# EAGLE schematic pcb (EAGLE 9.5.2)
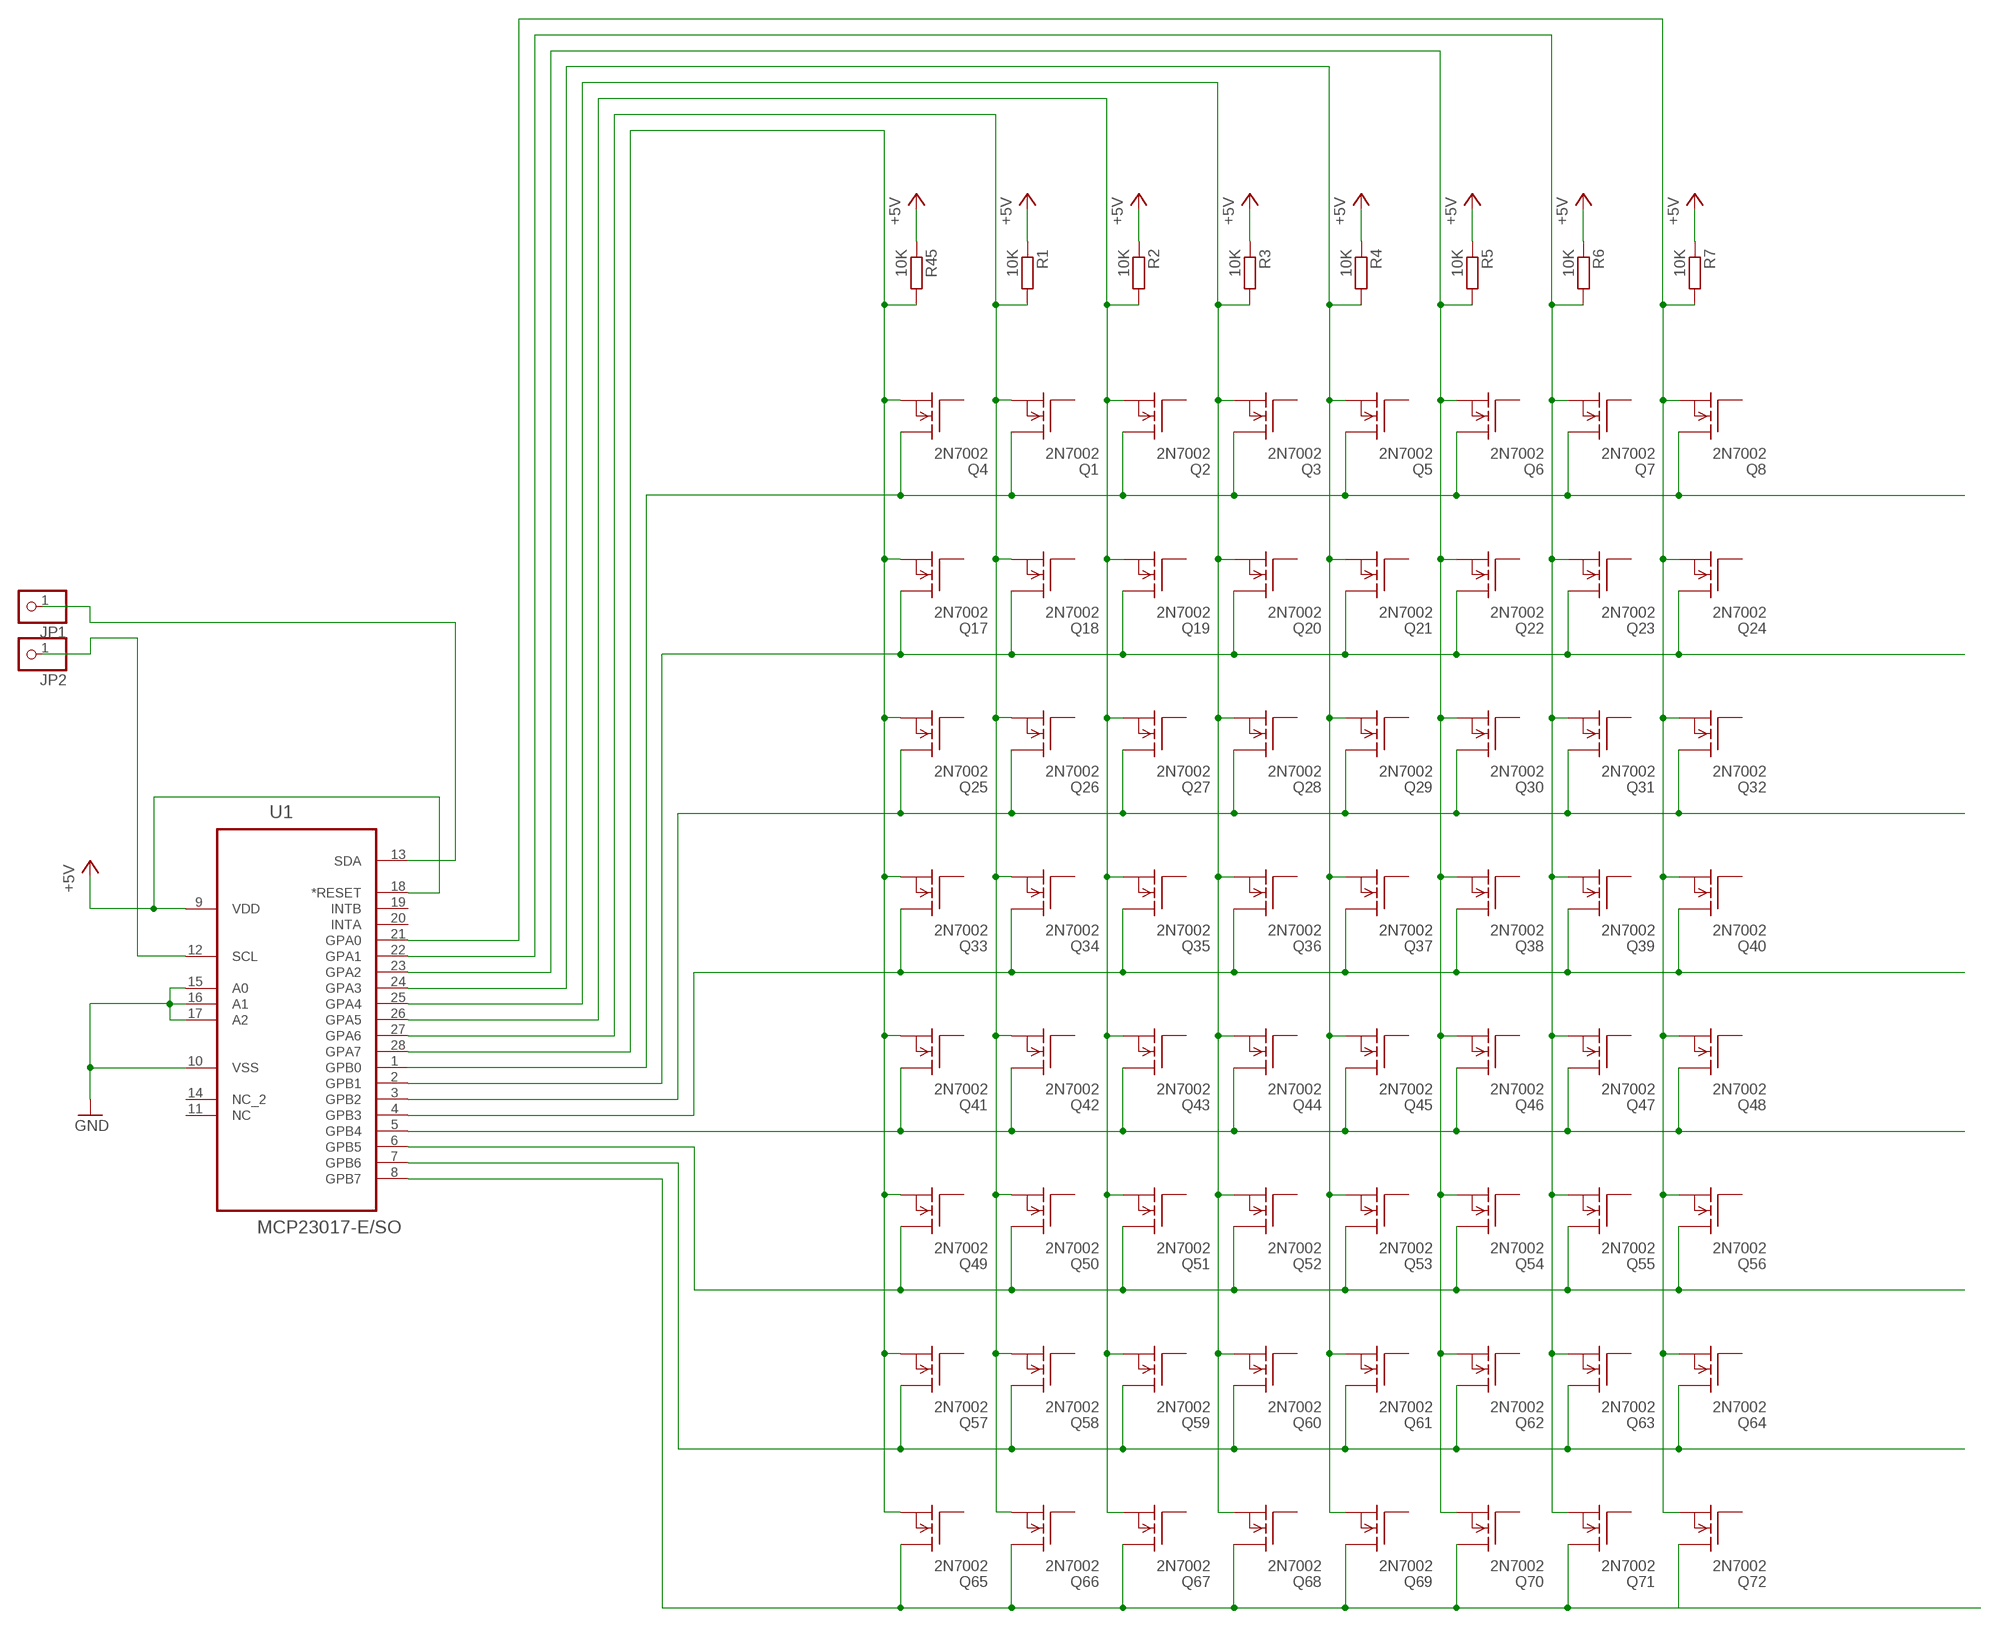
[diagram p0: schematic, sheet 1]

## Parts
JP1  PINHD-1X1  [1X01]
JP2  PINHD-1X1  [1X01]
Q1  2N7002  [SOT23]
Q2  2N7002  [SOT23]
Q3  2N7002  [SOT23]
Q4  2N7002  [SOT23]
Q5  2N7002  [SOT23]
Q6  2N7002  [SOT23]
Q7  2N7002  [SOT23]
Q8  2N7002  [SOT23]
Q17  2N7002  [SOT23]
Q18  2N7002  [SOT23]
Q19  2N7002  [SOT23]
Q20  2N7002  [SOT23]
Q21  2N7002  [SOT23]
Q22  2N7002  [SOT23]
Q23  2N7002  [SOT23]
Q24  2N7002  [SOT23]
Q25  2N7002  [SOT23]
Q26  2N7002  [SOT23]
Q27  2N7002  [SOT23]
Q28  2N7002  [SOT23]
Q29  2N7002  [SOT23]
Q30  2N7002  [SOT23]
Q31  2N7002  [SOT23]
Q32  2N7002  [SOT23]
Q33  2N7002  [SOT23]
Q34  2N7002  [SOT23]
Q35  2N7002  [SOT23]
Q36  2N7002  [SOT23]
Q37  2N7002  [SOT23]
Q38  2N7002  [SOT23]
Q39  2N7002  [SOT23]
Q40  2N7002  [SOT23]
Q41  2N7002  [SOT23]
Q42  2N7002  [SOT23]
Q43  2N7002  [SOT23]
Q44  2N7002  [SOT23]
Q45  2N7002  [SOT23]
Q46  2N7002  [SOT23]
Q47  2N7002  [SOT23]
Q48  2N7002  [SOT23]
Q49  2N7002  [SOT23]
Q50  2N7002  [SOT23]
Q51  2N7002  [SOT23]
Q52  2N7002  [SOT23]
Q53  2N7002  [SOT23]
Q54  2N7002  [SOT23]
Q55  2N7002  [SOT23]
Q56  2N7002  [SOT23]
Q57  2N7002  [SOT23]
Q58  2N7002  [SOT23]
Q59  2N7002  [SOT23]
Q60  2N7002  [SOT23]
Q61  2N7002  [SOT23]
Q62  2N7002  [SOT23]
Q63  2N7002  [SOT23]
Q64  2N7002  [SOT23]
Q65  2N7002  [SOT23]
Q66  2N7002  [SOT23]
Q67  2N7002  [SOT23]
Q68  2N7002  [SOT23]
Q69  2N7002  [SOT23]
Q70  2N7002  [SOT23]
Q71  2N7002  [SOT23]
Q72  2N7002  [SOT23]
R1  10K  R-EU_R0805  [R0805]
R2  10K  R-EU_R0805  [R0805]
R3  10K  R-EU_R0805  [R0805]
R4  10K  R-EU_R0805  [R0805]
R5  10K  R-EU_R0805  [R0805]
R6  10K  R-EU_R0805  [R0805]
R7  10K  R-EU_R0805  [R0805]
R45  10K  R-EU_R0805  [R0805]
U1  MCP23017-E/SO  [SOIC127P1032X265-28N]

## Nets
+5V: R1.1 R2.1 R3.1 R4.1 R5.1 R6.1 R7.1 R45.1 U1.9(VDD) U1.18(*RESET)
GND: U1.10(VSS) U1.15(A0) U1.16(A1) U1.17(A2)
N$9: Q1.3(D) Q2.3(D) Q3.3(D) Q4.3(D) Q5.3(D) Q6.3(D) Q7.3(D) Q8.3(D) U1.1(GPB0)
N$10: JP2.1 U1.12(SCL)
N$11: Q57.3(D) Q58.3(D) Q59.3(D) Q60.3(D) Q61.3(D) Q62.3(D) Q63.3(D) Q64.3(D) U1.7(GPB6)
N$27: Q17.3(D) Q18.3(D) Q19.3(D) Q20.3(D) Q21.3(D) Q22.3(D) Q23.3(D) Q24.3(D) U1.2(GPB1)
N$36: Q25.3(D) Q26.3(D) Q27.3(D) Q28.3(D) Q29.3(D) Q30.3(D) Q31.3(D) Q32.3(D) U1.3(GPB2)
N$45: Q33.3(D) Q34.3(D) Q35.3(D) Q36.3(D) Q37.3(D) Q38.3(D) Q39.3(D) Q40.3(D) U1.4(GPB3)
N$54: Q41.3(D) Q42.3(D) Q43.3(D) Q44.3(D) Q45.3(D) Q46.3(D) Q47.3(D) Q48.3(D) U1.5(GPB4)
N$63: Q49.3(D) Q50.3(D) Q51.3(D) Q52.3(D) Q53.3(D) Q54.3(D) Q55.3(D) Q56.3(D) U1.6(GPB5)
N$73: Q4.2(S) Q17.2(S) Q25.2(S) Q33.2(S) Q41.2(S) Q49.2(S) Q57.2(S) Q65.2(S) R45.2 U1.28(GPA7)
N$74: Q1.2(S) Q18.2(S) Q26.2(S) Q34.2(S) Q42.2(S) Q50.2(S) Q58.2(S) Q66.2(S) R1.2 U1.27(GPA6)
N$75: Q2.2(S) Q19.2(S) Q27.2(S) Q35.2(S) Q43.2(S) Q51.2(S) Q59.2(S) Q67.2(S) R2.2 U1.26(GPA5)
N$76: Q3.2(S) Q20.2(S) Q28.2(S) Q36.2(S) Q44.2(S) Q52.2(S) Q60.2(S) Q68.2(S) R3.2 U1.25(GPA4)
N$77: Q5.2(S) Q21.2(S) Q29.2(S) Q37.2(S) Q45.2(S) Q53.2(S) Q61.2(S) Q69.2(S) R4.2 U1.24(GPA3)
N$78: Q6.2(S) Q22.2(S) Q30.2(S) Q38.2(S) Q46.2(S) Q54.2(S) Q62.2(S) Q70.2(S) R5.2 U1.23(GPA2)
N$79: Q7.2(S) Q23.2(S) Q31.2(S) Q39.2(S) Q47.2(S) Q55.2(S) Q63.2(S) Q71.2(S) R6.2 U1.22(GPA1)
N$80: Q8.2(S) Q24.2(S) Q32.2(S) Q40.2(S) Q48.2(S) Q56.2(S) Q64.2(S) Q72.2(S) R7.2 U1.21(GPA0)
N$81: Q65.3(D) Q66.3(D) Q67.3(D) Q68.3(D) Q69.3(D) Q70.3(D) Q71.3(D) Q72.3(D) U1.8(GPB7)
SDA_OUT: JP1.1 U1.13(SDA)
Unconnected: Q1.1(G) Q2.1(G) Q3.1(G) Q4.1(G) Q5.1(G) Q6.1(G) Q7.1(G) Q8.1(G) Q17.1(G) Q18.1(G) Q19.1(G) Q20.1(G) Q21.1(G) Q22.1(G) Q23.1(G) Q24.1(G) Q25.1(G) Q26.1(G) Q27.1(G) Q28.1(G) Q29.1(G) Q30.1(G) Q31.1(G) Q32.1(G) Q33.1(G) Q34.1(G) Q35.1(G) Q36.1(G) Q37.1(G) Q38.1(G) Q39.1(G) Q40.1(G) Q41.1(G) Q42.1(G) Q43.1(G) Q44.1(G) Q45.1(G) Q46.1(G) Q47.1(G) Q48.1(G) Q49.1(G) Q50.1(G) Q51.1(G) Q52.1(G) Q53.1(G) Q54.1(G) Q55.1(G) Q56.1(G) Q57.1(G) Q58.1(G) Q59.1(G) Q60.1(G) Q61.1(G) Q62.1(G) Q63.1(G) Q64.1(G) Q65.1(G) Q66.1(G) Q67.1(G) Q68.1(G) Q69.1(G) Q70.1(G) Q71.1(G) Q72.1(G) U1.11(NC) U1.14(NC_2) U1.19(INTB) U1.20(INTA)

## Library data of the parts
JP1 JP2 = adafruit:PINHD-1X1: Pin header 1x1 for 0.1" spacing With round pins
Q1-Q8 Q17-Q72 = transistors_gaui:2N7002
R1-R7 R45 = rcl:R-EU_: RESISTOR, European symbol; SPICEPREFIX: R
U1 = MCP23017-ESO:MCP23017-E/SO: IC, 16-Bit I/O Expander with Serial Interface, SOIC-28; MPN: MCP23017-E/SO; OC_FARNELL: 1332087; OC_NEWARK: 34M7442; PACKAGE: SOIC-28; SUPPLIER: Microchip